# EAGLE schematic Greippi (EAGLE 7.4.0)
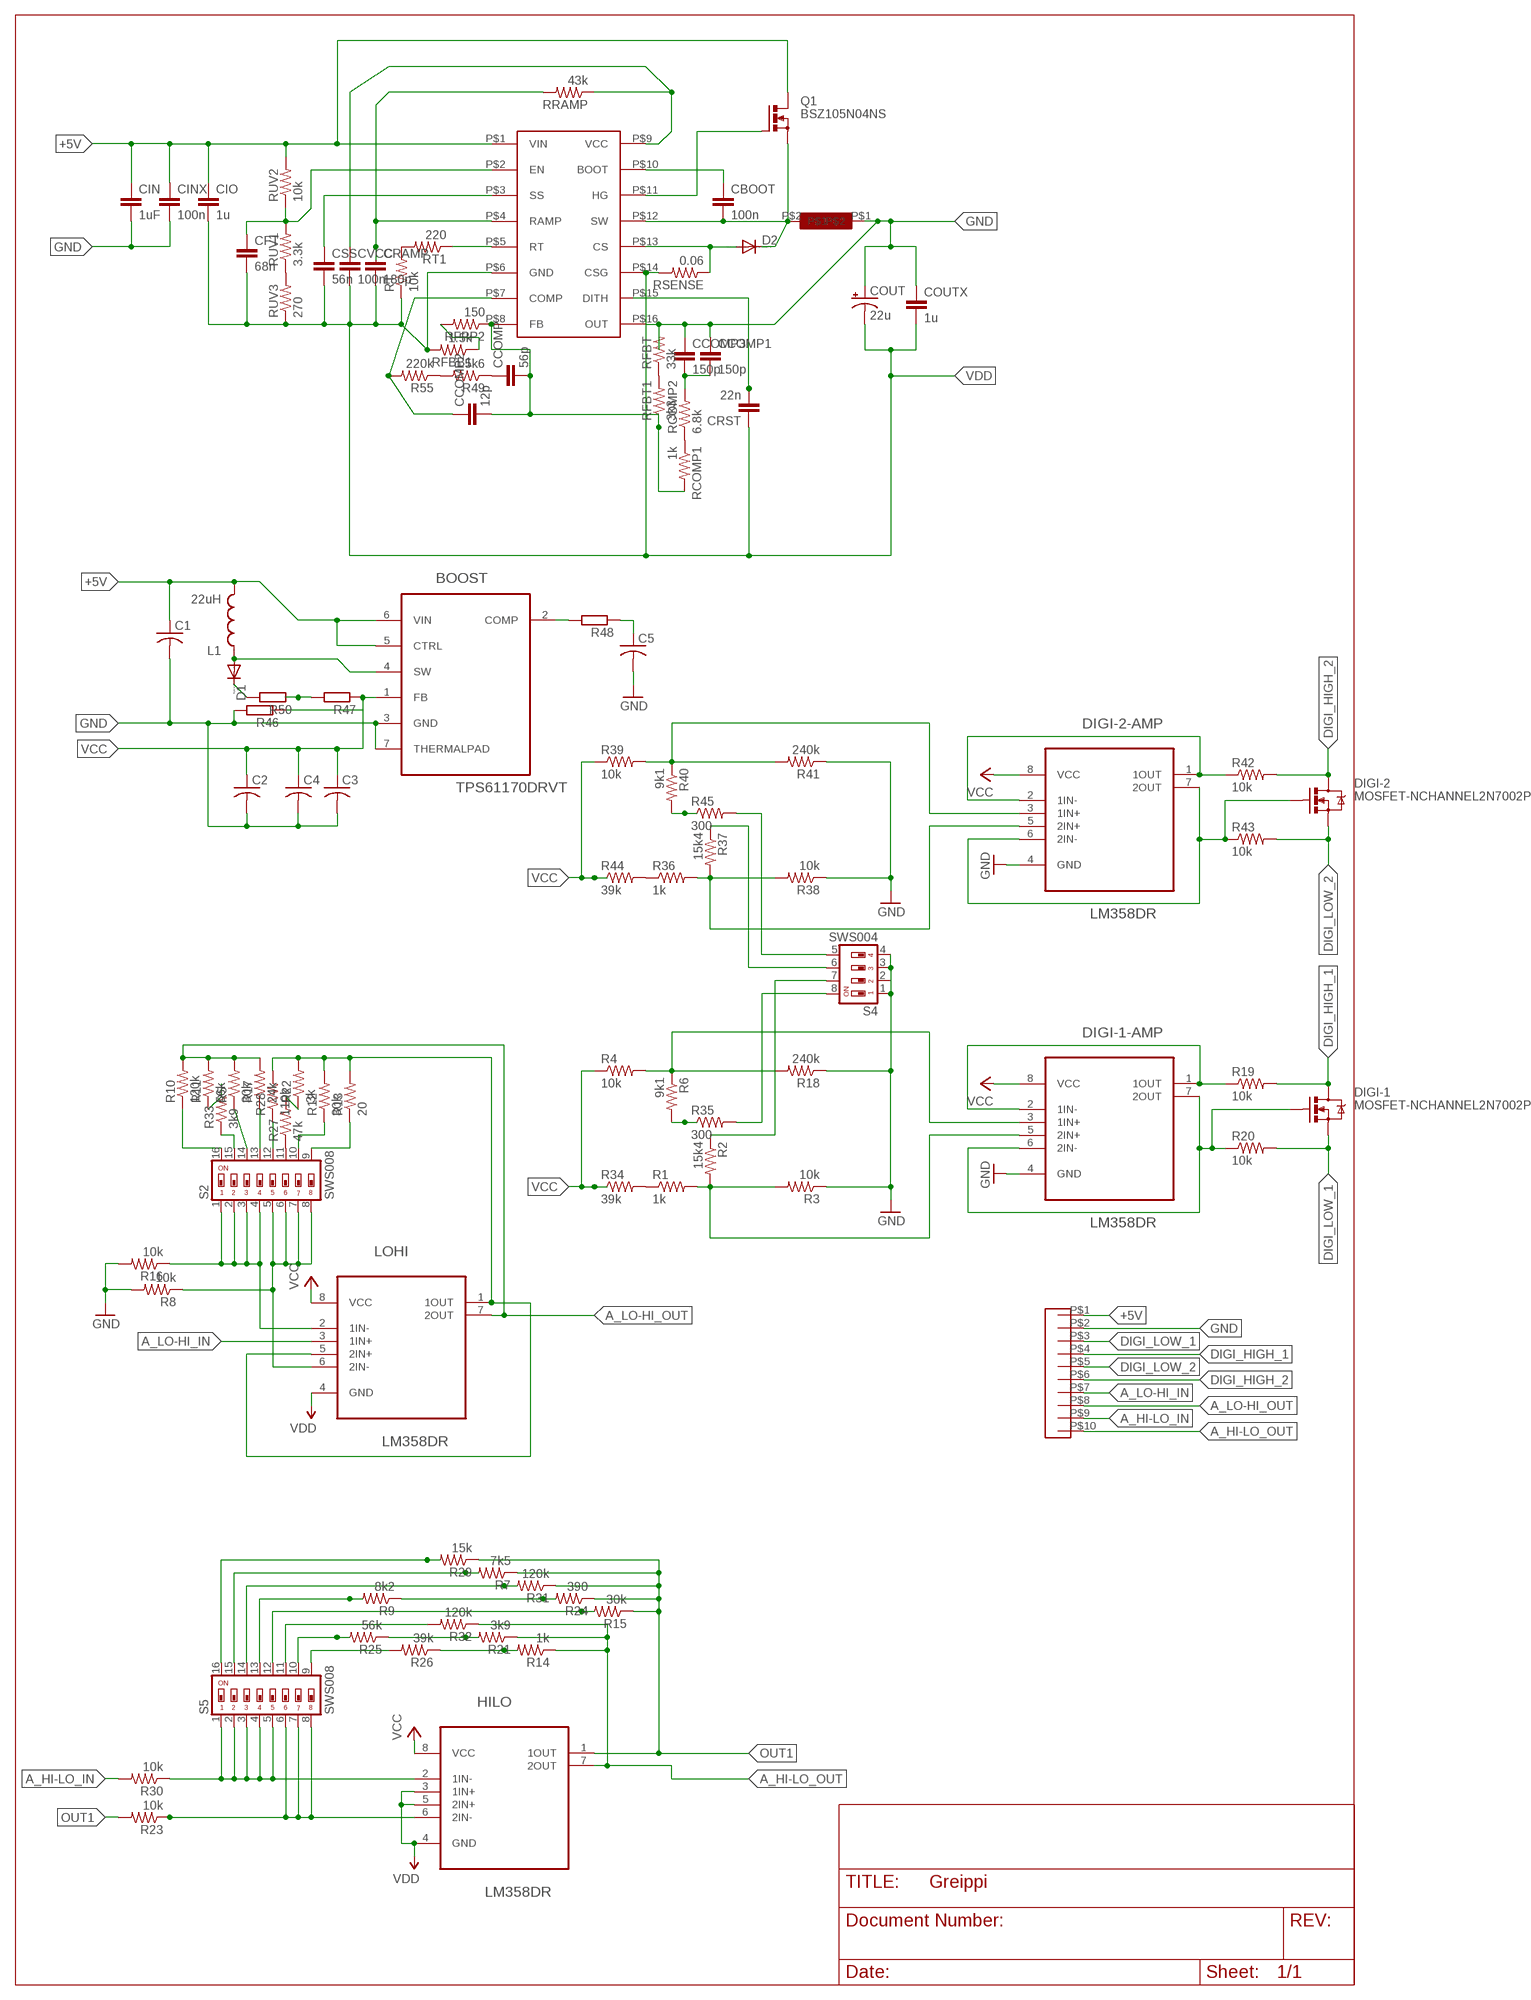
[diagram p0: schematic, sheet 1]

## Parts
BOOST  TPS61170DRVT  [SON65P210X210X80-7N]
C1  C-USC1206  [C1206]
C2  C-USC0805  [C0805]
C3  C-USC1206  [C1206]
C4  C-USC1206  [C1206]
C5  C-USC1206  [C1206]
CBOOT  100n  C-EUC0805  [C0805]
CCOMP  56p  C-EUC0805  [C0805]
CCOMP1  150p  C-EUC0805  [C0805]
CCOMP2  12p  C-EUC0805  [C0805]
CCOMP3  150p  C-EUC0805  [C0805]
CFT  68n  C-EUC0805  [C0805]
CIN  1uF  C-EUC0805  [C0805]
CINX  100n  C-EUC0805  [C0805]
CIO  1u  C-EUC0805  [C0805]
COUT  22u  CPOL-USE5-5  [E5-5]
COUTX  1u  C-EUC0805  [C0805]
CRAMP  180p  C-EUC0805  [C0805]
CRST  22n  C-EUC0805  [C0805]
CSS  56n  C-EUC0805  [C0805]
CVCC  100n  C-EUC0805  [C0805]
D1  DIODE-SOD123  [SOD123]
D2  DIODE-SOD123  [SOD123]
DIGI-1  MOSFET-NCHANNEL2N7002PW  [SOT323]
DIGI-1-AMP  LM358DR  [SOIC127P600X175-8N]
DIGI-2  MOSFET-NCHANNEL2N7002PW  [SOT323]
DIGI-2-AMP  LM358DR  [SOIC127P600X175-8N]
HILO  LM358DR  [SOIC127P600X175-8N]
L1  22uH  INDUCTORBOURNS_SRN6045  [SRN6045]
LOHI  LM358DR  [SOIC127P600X175-8N]
Q1  BSZ105N04NS  [PG-TDSON-8]
R1  1k  R-US_R0805  [R0805]
R2  15k4  R-US_R0805  [R0805]
R3  10k  R-US_R0805  [R0805]
R4  10k  R-US_R0805  [R0805]
R5  30k  R-US_R0805  [R0805]
R6  9k1  R-US_R0805  [R0805]
R7  7k5  R-US_R0805  [R0805]
R8  10k  R-US_R0805  [R0805]
R9  8k2  R-US_R0805  [R0805]
R10  120k  R-US_R0805  [R0805]
R11  56k  R-US_R0805  [R0805]
R12  30k  R-US_R0805  [R0805]
R13  20  R-US_R0805  [R0805]
R14  1k  R-US_R0805  [R0805]
R15  30k  R-US_R0805  [R0805]
R16  10k  R-US_R0805  [R0805]
R17  24k  R-US_R0805  [R0805]
R18  240k  R-US_R0805  [R0805]
R19  10k  R-US_R0805  [R0805]
R20  10k  R-US_R0805  [R0805]
R21  3k9  R-US_R0805  [R0805]
R22  3k  R-US_R0805  [R0805]
R23  10k  R-US_R0805  [R0805]
R24  390  R-US_R0805  [R0805]
R25  56k  R-US_R0805  [R0805]
R26  39k  R-US_R0805  [R0805]
R27  47k  R-US_R0805  [R0805]
R28  110k  R-US_R0805  [R0805]
R29  15k  R-US_R0805  [R0805]
R30  10k  R-US_R0805  [R0805]
R31  120k  R-US_R0805  [R0805]
R32  120k  R-US_R0805  [R0805]
R33  3k9  R-US_R0805  [R0805]
R34  39k  R-US_R0805  [R0805]
R35  300  R-US_R0805  [R0805]
R36  1k  R-US_R0805  [R0805]
R37  15k4  R-US_R0805  [R0805]
R38  10k  R-US_R0805  [R0805]
R39  10k  R-US_R0805  [R0805]
R40  9k1  R-US_R0805  [R0805]
R41  240k  R-US_R0805  [R0805]
R42  10k  R-US_R0805  [R0805]
R43  10k  R-US_R0805  [R0805]
R44  39k  R-US_R0805  [R0805]
R45  300  R-US_R0805  [R0805]
R46  R-EU_R0805  [R0805]
R47  R-EU_R0805  [R0805]
R48  R-EU_R0805  [R0805]
R49  5k6  R-US_R0805  [R0805]
R50  R-EU_R0805  [R0805]
R55  220k  R-US_R0805  [R0805]
RCOMP1  1k  R-US_R0805  [R0805]
RCOMP2  6.8k  R-US_R0805  [R0805]
RFBB1  1.5k  R-US_R0805  [R0805]
RFBT  33k  R-US_R0805  [R0805]
RFBT1  3k3  R-US_R0805  [R0805]
RFPP2  150  R-US_R0805  [R0805]
RRAMP  43k  R-US_R0805  [R0805]
RSENSE  0.06  R-US_R0805  [R0805]
RT  10k  R-US_R0805  [R0805]
RT1  220  R-US_R0805  [R0805]
RUV1  3.3k  R-US_R0805  [R0805]
RUV2  10k  R-US_R0805  [R0805]
RUV3  270  R-US_R0805  [R0805]
S2  SWS008  [SMS-008]
S4  SWS004  [SMS-004]
S5  SWS008  [SMS-008]
U$1  5.08PITCHTERMINAL  [10KPL508]
U$2  LM5088  [LM5088]
U$3  KLICK_INDUCTOR01  [KLICK_INDUCTOR01]

## Nets
+5V: BOOST.5(CTRL) BOOST.6(VIN) C1.1 CIN.1 CINX.1 CIO.1 L1.2 Q1.5(D) Q1.6(D) Q1.7(D) Q1.8(D) Q1.TH(D) RUV2.2 U$1.P$1 U$2.P$1(VIN)
A_HI-LO_IN: R30.2 U$1.P$9
A_HI-LO_OUT: HILO.7(2OUT) R14.1 R21.1 R32.1 U$1.P$10
A_LO-HI_IN: LOHI.3(1IN+) U$1.P$7
A_LO-HI_OUT: LOHI.7(2OUT) R5.2 R10.2 R11.2 R17.2 U$1.P$8
DI-1: DIGI-1-AMP.1(1OUT) DIGI-1-AMP.2(1IN-) R19.1
DIGI_HIGH_1: DIGI-1.3(D) R19.2 U$1.P$4
DIGI_HIGH_2: DIGI-2.3(D) R42.2 U$1.P$6
DIGI_LOW_1: DIGI-1.2(S) R20.2 U$1.P$3
DIGI_LOW_2: DIGI-2.2(S) R43.2 U$1.P$5
GND: BOOST.3(GND) BOOST.7(THERMALPAD) C1.2 C2.2 C3.2 C4.2 C5.2 CCOMP1.1 CCOMP3.1 CIN.2 CINX.2 COUT.+ COUTX.1 DIGI-1-AMP.4(GND) DIGI-2-AMP.4(GND) R3.1 R8.2 R16.2 R18.1 R38.1 R41.1 R46.2 RFBT.2 S4.1 S4.2 S4.3 S4.4 U$1.P$2 U$2.P$16(OUT) U$3.P$1
N$2: DIGI-1-AMP.3(1IN+) R4.2 R6.1 R18.2
N$4: R2.1 S4.7
N$5: R6.2 R35.1
N$6: DIGI-1-AMP.5(2IN+) R1.2 R2.2 R3.2
N$8: DIGI-1-AMP.6(2IN-) DIGI-1-AMP.7(2OUT) DIGI-1.1(G) R20.1
N$9: DIGI-2-AMP.5(2IN+) R36.2 R37.2 R38.2
N$10: HILO.2(1IN-) R30.1 S5.1 S5.2 S5.3 S5.4 S5.5
N$11: DIGI-2-AMP.3(1IN+) R39.2 R40.1 R41.2
N$13: R10.1 S2.16
N$14: R33.1 S2.15
N$15: R1.1 R34.2
N$16: R5.1 S2.14
N$17: R17.1 S2.13
N$18: R28.1 S2.12
N$19: R27.1 S2.11
N$20: R12.1 S2.10
N$21: R13.1 S2.9
N$22: R29.2 S5.16
N$23: LOHI.1(1OUT) LOHI.5(2IN+) R12.2 R13.2 R22.2 R28.2
N$24: R7.2 S5.15
N$26: R31.2 S5.14
N$27: R9.2 S5.13
N$28: R15.2 S5.12
N$29: R32.2 S5.11
N$30: HILO.6(2IN-) R23.1 S5.6 S5.7 S5.8
N$31: R25.2 S5.10
N$32: R26.2 S5.9
N$34: R14.2 R26.1
N$36: R21.2 R25.1
N$37: R9.1 R24.2
N$38: R22.1 R27.2
N$41: R11.1 R33.2
N$42: R35.2 S4.8
N$43: CFT.1 RUV1.2 RUV2.1 U$2.P$2(EN)
N$44: BOOST.4(SW) D1.A L1.1
N$45: CSS.1 U$2.P$3(SS)
N$46: LOHI.2(1IN-) R16.1 S2.1 S2.2 S2.3 S2.4
N$47: R47.2 R50.1
N$48: CVCC.1 RRAMP.1 U$2.P$9(VCC)
N$49: BOOST.2(COMP) R48.2
N$50: LOHI.6(2IN-) R8.1 S2.5 S2.6 S2.7 S2.8
N$51: C5.1 R48.1
N$52: D2.A RSENSE.1 U$2.P$13(CS)
N$53: CRAMP.1 RRAMP.2 U$2.P$4(RAMP)
N$54: RT1.2 RT.2
N$55: RUV1.1 RUV3.2
N$56: CCOMP.1 R49.1
N$57: CCOMP2.2 CCOMP.2 RCOMP1.2 RFBT1.1 RFPP2.1 U$2.P$8(FB)
N$58: CCOMP2.1 R55.2 U$2.P$7(COMP)
N$59: CBOOT.1 U$2.P$10(BOOT)
N$60: CRST.2 U$2.P$15(DITH)
N$61: CBOOT.2 D2.C Q1.1(S) Q1.2(S) Q1.3(S) U$2.P$12(SW) U$3.P$2
N$62: RFBB1.1 RFPP2.2
N$63: DIGI-2-AMP.1(1OUT) DIGI-2-AMP.2(1IN-) R42.1
N$64: DIGI-2-AMP.6(2IN-) DIGI-2-AMP.7(2OUT) DIGI-2.1(G) R43.1
N$65: Q1.4(G) U$2.P$11(HG)
N$66: R49.2 R55.1
N$67: R37.1 S4.6
N$68: R36.1 R44.2
N$69: R40.2 R45.1
N$70: R45.2 S4.5
N$71: CCOMP1.2 CCOMP3.2 RCOMP2.2
N$72: RT1.1 U$2.P$5(RT)
N$73: RCOMP1.1 RCOMP2.1
N$74: RFBT1.2 RFBT.1
N$75: D1.C R50.2
OUT1: HILO.1(1OUT) R7.1 R15.1 R23.2 R24.1 R29.1 R31.1
VCC: BOOST.1(FB) C2.1 C3.1 C4.1 DIGI-1-AMP.8(VCC) DIGI-2-AMP.8(VCC) HILO.8(VCC) LOHI.8(VCC) R4.1 R34.1 R39.1 R44.1 R46.1 R47.1
VDD: CFT.2 CIO.2 COUT.- COUTX.2 CRAMP.2 CRST.1 CSS.2 CVCC.2 HILO.3(1IN+) HILO.4(GND) HILO.5(2IN+) LOHI.4(GND) RFBB1.2 RSENSE.2 RT.1 RUV3.1 U$2.P$6(GND) U$2.P$14(CSG)

## Library data of the parts
BOOST = Texas Instruments_By_element14_Batch_1:TPS61170DRVT: 1.2A High Voltage Boost Converter in 2x2mm2 QFN Package; MPN: TPS61170DRVT; OC_FARNELL: 1703404; OC_NEWARK: 65M6342; PACKAGE: SON-6; SUPPLIER: Texas Instruments
C1-C5 = rcl:C-US: CAPACITOR, American symbol
CBOOT CCOMP CCOMP1-CCOMP3 CFT CIN CINX CIO COUTX CRAMP CRST CSS CVCC = rcl:C-EU: CAPACITOR, European symbol
COUT = rcl:CPOL-US: POLARIZED CAPACITOR, American symbol
D1 D2 = diode:DIODE-: DIODE
DIGI-1 DIGI-2 = SparkFun-DiscreteSemi:MOSFET-NCHANNEL: Common NMOSFET Parts MFG P/N Store ID Prod ID FDD8780 TRANS-09984 SI7820DN TRANS-11055 FDS6630A IC-08089 2N7002PW TRANS-11151 FQP30N06L COM-10213 TRANS-10060 BSS123LT1G TRANS-08345 BSS138 TRANS-00830 BS170 2N7000; PROD_ID: TRANS-11151
DIGI-1-AMP DIGI-2-AMP HILO LOHI = Texas Instruments_By_element14_Batch_1:LM358DR: OPERATIONAL AMPLIFIERS; MPN: LM358DR; OC_FARNELL: 1831865; OC_NEWARK: 34K7599; PACKAGE: SOIC-8; SUPPLIER: Texas Instruments
L1 = SparkFun-Passives:INDUCTOR: Inductors Basic Inductor/Choke - 0603 and 1206. Footprints are not proven and vary greatly between part numbers. INDUCTOR POWER 3.3UH 4.0A SMD 0.197" L x 0.197" W x 0.177" H (5.00mm x 5.00mm x 4.50mm); PROD_ID: NDUC-11627; VALUE: 33uH
Q1 = transistor-power:BSZ105N04NS: OptiMOS (TM)3 Power-Transistor N-Channel, Normal level Source : Data sheet <http://www.infineon.com/dgdl/BSZ105N04NSG_rev1.1.pdf?folderId=db3a3043156fd5730115c7d50620107c&fileId=db3a30431689f4420116c485c67f084e>
R1-R45 R49 R55 RCOMP1 RCOMP2 RFBB1 RFBT RFBT1 RFPP2 RRAMP RSENSE RT RT1 RUV1-RUV3 = rcl:R-US_: RESISTOR, American symbol
R46-R48 R50 = rcl:R-EU_: RESISTOR, European symbol
S2 S5 = smd-special:SWS008: SMD Dip Switch 8 pol.
S4 = smd-special:SWS004: SMD Dip Switch 4 pol.
U$1 = ruuviliitin:5.08PITCHTERMINAL
U$2 = Klick_custom_lm5088:LM5088
U$3 = Klick_inductor01:KLICK_INDUCTOR01